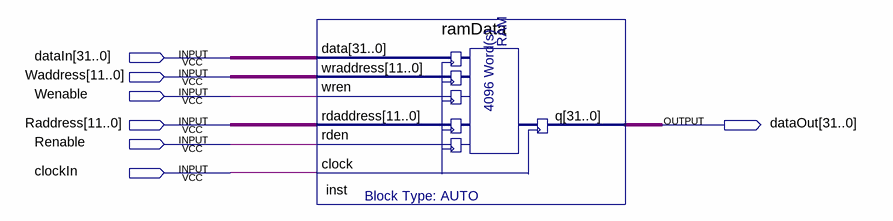
[diagram p0: schematic sheet]
// Quartus schematic teste_dataRam.bdf as structural Verilog: 1 symbols, 7 pins
module teste_dataRam (
  input  [31:0] dataIn,
  input  [11:0] Waddress,
  input  Wenable,
  input  [11:0] Raddress,
  input  Renable,
  input  clockIn,
  output [31:0] dataOut
);

  ramData inst (
    .data(dataIn), .wraddress(Waddress), .wren(Wenable), .rdaddress(Raddress), .rden(Renable),
    .clock(clockIn), .q(dataOut));
endmodule
